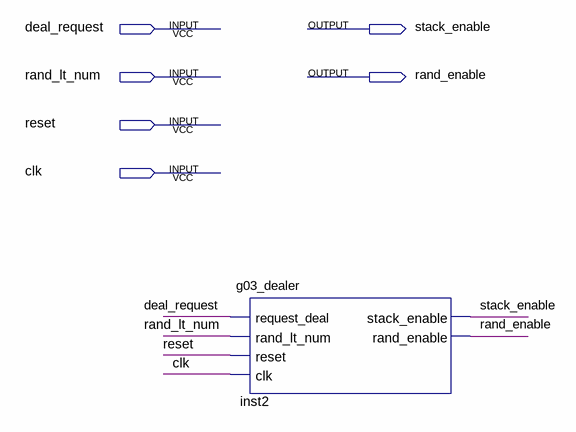
[diagram p0: schematic sheet]
// Quartus schematic g03_lab4_dealer.bdf as structural Verilog: 1 symbols, 6 pins
module g03_lab4_dealer (
  input  deal_request,
  input  rand_lt_num,
  input  reset,
  input  clk,
  output stack_enable,
  output rand_enable
);

  g03_dealer inst2 (
    .request_deal(deal_request), .rand_lt_num(rand_lt_num), .reset(reset), .clk(clk),
    .stack_enable(stack_enable), .rand_enable(rand_enable));
endmodule
